# EAGLE design 236_pressure (EAGLE 9.6.2)
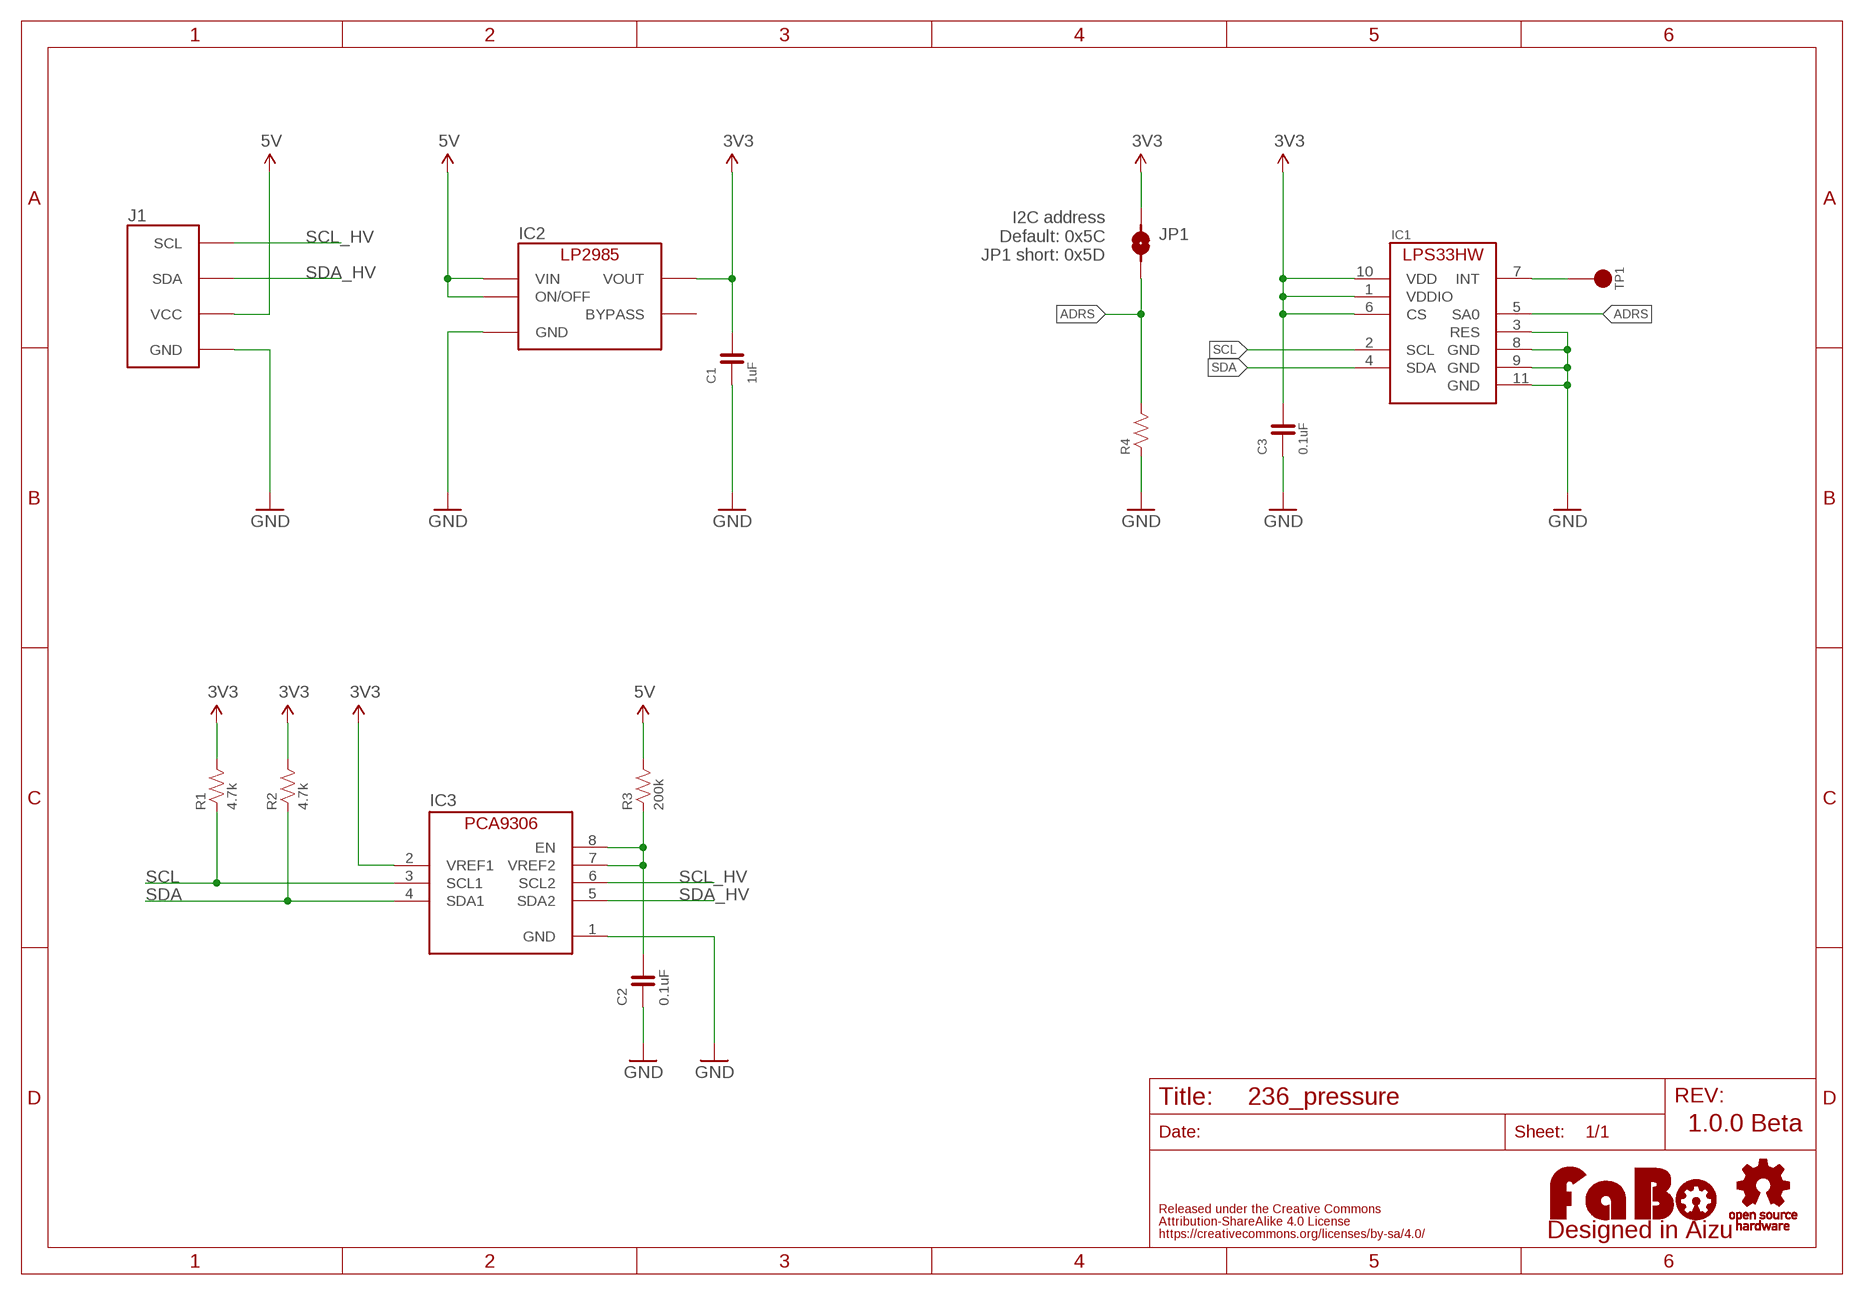
[diagram p0: schematic, sheet 1]

## Parts
C1  1uF  CAPACITOR-0603  [EIA0603]
C2  0.1uF  CAPACITOR-0603  [0603]
C3  0.1uF  CAPACITOR-0603  [EIA0603]
IC1  LPS33HW  [LPS33HW]
IC2  LP2985-33DBV  [SOT-23-5]
IC3  PCA9306GM  [XQFN8]
J1  FABO_BRICK_I2C  [FABO_BRICK_I2C]
JP1  JUMPER-2_SMD  [JUMPER-SMD-2]
LOGO1  LOGO_FABO-M  [LOGO_FABO_M]
R1  4.7k  RESISTOR-0603  [0603]
R2  4.7k  RESISTOR-0603  [0603]
R3  200k  RESISTOR-0603  [0603]
R4  RESISTOR-0603  [EIA0603]
TP1  TP-15  [TP-15]
U$2  LOGO_OSHW-M_BOTTOM  [LOGO_OSHW_M_BOTTOM]

## Nets
3V3: C1.2 C3.2 IC1.1(VDDIO) IC1.6(CS) IC1.10(VDD) IC2.5(VOUT) IC3.2(VREF1) JP1.1 R1.2 R2.2
5V: IC2.1(VIN) IC2.3(ON/OFF) J1.VCC R3.2
ADRS: IC1.5(SA0) JP1.2 R4.2
GND: C1.1 C2.1 C3.1 IC1.3(RES) IC1.8(GND) IC1.9(GND) IC1.11(GND) IC2.2(GND) IC3.1(GND) J1.GND R4.1
N$1: C2.2 IC3.7(VREF2) IC3.8(EN) R3.1
N$5: IC1.7(INT) TP1.1
SCL: IC1.2(SCL) IC3.3(SCL1) R1.1
SCL_HV: IC3.6(SCL2) J1.SCL
SDA: IC1.4(SDA) IC3.4(SDA1) R2.1
SDA_HV: IC3.5(SDA2) J1.SDA
Unconnected: IC2.4(BYPASS)

## Notes on the sheet
- I2C address
  Default: 0x5C
  JP1 short: 0x5D
- 1.0.0 Beta

## Library data of the parts
C1 C3 = component:CAPACITOR
C2 = FaBo-Capacitor:CAPACITOR: CAPACITOR
IC1 = component:LPS33HW
IC2 = FaBo-Supply:LP2985: LP2985
IC3 = FaBo-LevelTranslator:PCA9306
J1 = FaBo-Template:FABO_BRICK_I2C: FaBo Brick I2C
JP1 = component:JUMPER-2
LOGO1 = component:LOGO_FABO
R1-R3 = FaBo-Resistors:RESISTOR: RESISTOR
R4 = component:RESISTOR
TP1 = component:TP
U$2 = FaBo-etc:LOGO_OSHW

## Board
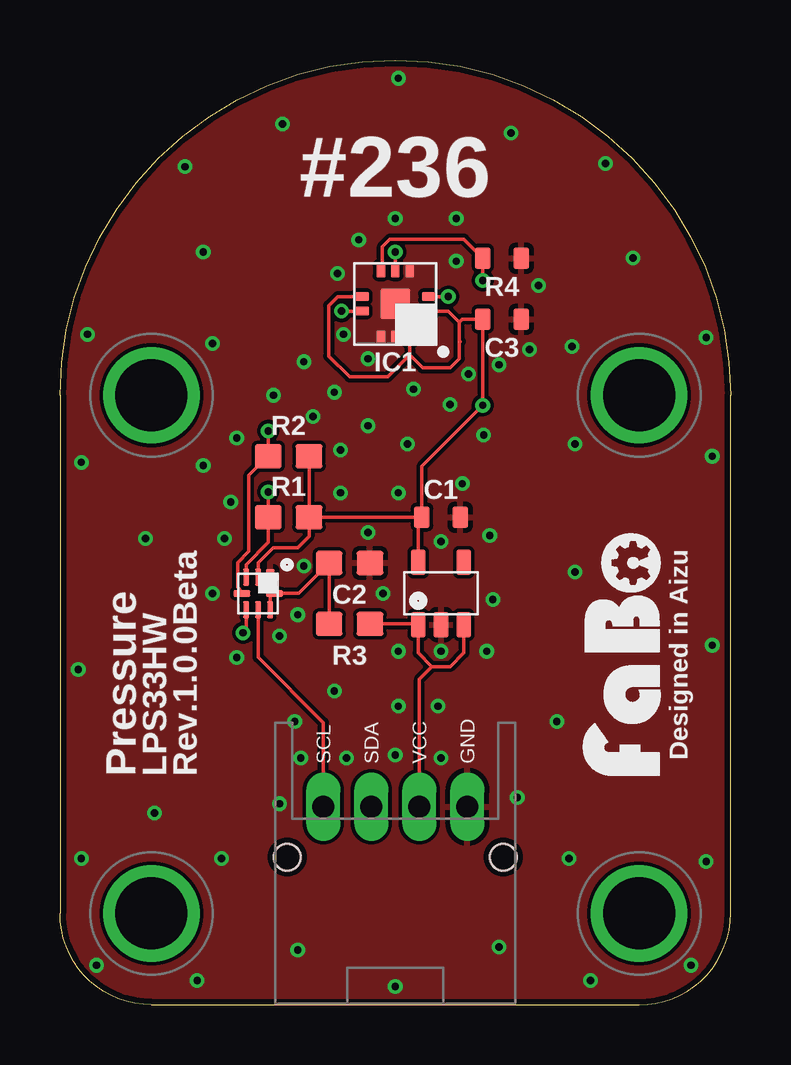
[diagram p1: board, top side]
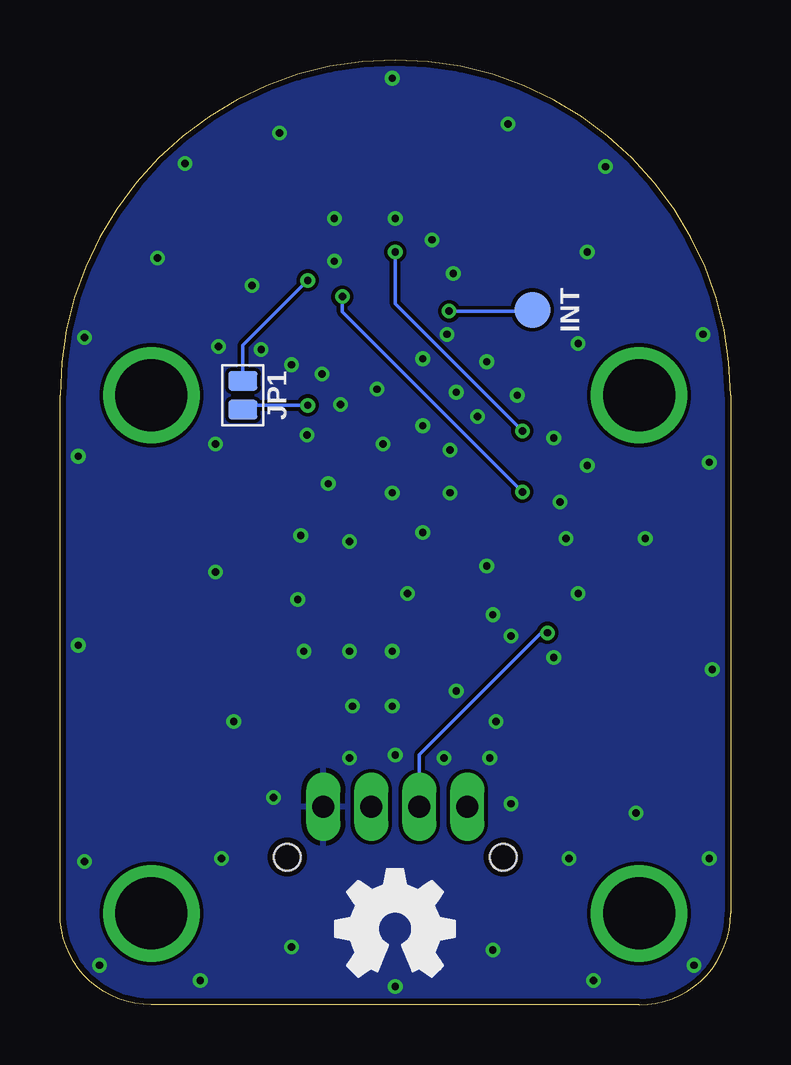
[diagram p2: board, bottom side, seen from below]

Size 27.94 x 39.37 mm. Coordinates in mm from the lower left corner, seen from the top.
Copper layers (1*16): Top 0.035mm / dielectric 1.6mm / Bottom 0.035mm
Design rules "PCBway": minimum track width 6mil, minimum drill 12mil, track to track 6mil, track to pad 6mil, pad to pad 6mil, via to via 6mil, smd to smd 6mil, copper to edge 10mil, drill to drill 10mil, minimum pad ring 10mil, minimum via ring 6mil, stop-mask expansion 2mil, vias tented up to drill 100mil, thermal gap 8mil

### Footprints (pad centres in the part's own frame; a part is rotated, then mirrored left to right if it is on the bottom)
EIA0603 = smd 0.65 x 0.9: 1 -0.8,0; 2 0.8,0
0603 = smd 1.1 x 1: 1 -0.85,0; 2 0.85,0
LPS33HW = smd 0.6 x 0.375: 1 -1.4,0.3; 2 -1.4,-0.3; 6 1.4,-0.3; 7 1.4,0.3 | smd 0.375 x 0.6: 3 -0.6,-1.4; 4 0,-1.4; 5 0.6,-1.4; 8 0.6,1.4; 9 0,1.4; 10 -0.6,1.4 | smd 1.25 x 1.25: 11 0,0
SOT-23-5 = smd 0.6 x 1.05: 1 -0.95,-1.3; 2 0,-1.3; 3 0.95,-1.3; 4 0.95,1.3; 5 -0.95,1.3
XQFN8 = smd 0.7 x 0.35: 1 -0.675,0.5 | smd 0.7 x 0.25: 2 -0.675,0; 3 -0.675,-0.5; 5 0.675,-0.5; 6 0.675,0; 7 0.675,0.5 | smd 0.25 x 0.7: 4 0,-0.675; 8 0,0.675
FABO_BRICK_I2C = drill 0.9 pad 1.422 long: GND 3,-10.795; SCL -3,-10.795; SDA -1,-10.795; VCC 1,-10.795 | drill 3 pad 3.81: P$1 -10.16,6.35; P$2 10.16,6.35; P$3 -10.16,-15.24; P$4 10.16,-15.24 | hole 1.1: -4.5,-12.895; 4.5,-12.895
JUMPER-SMD-2 = smd 0.8 x 1.2: 1 -0.6,0; 2 0.6,0
TP-15 = smd 1.5 x 1.5: 1 0,0

### Placement (x,y rotation side)
C1  15.88,20.32 180 top
C2  12.06,18.41 180 top
C3  18.41,28.57 180 top
IC1  13.97,29.21 180 top
IC2  15.88,17.14 0 top
IC3  8.26,17.14 270 top
J1  13.97,19.05 0 top
JP1  20.32,25.4 90 bottom
LOGO1  25.4,14.61 90 top
R1  9.53,20.32 0 top
R2  9.53,22.86 0 top
R3  12.06,15.88 0 top
R4  18.41,31.11 180 top
TP1  8.26,28.96 0 bottom
U$2  13.97,3.17 0 top

### Tracks (layer width: path | path; a pad name or v marks a point on that pad's centre or on a via)
3V3  (via drill 0.3)
  Top 0.152: C1.2 15.07,22.44 v17.61,24.98 C3.2 16.76,28.57 16.64,28.45 | 16.68,27.64 16.64,27.64 | IC1.10 14.57,27.09 | 14.57,27.09 15.11,26.54 16.26,26.54 16.64,26.92 16.64,27.64 | IC1.1 16.18,28.91 16.64,28.45 | 16.64,27.64 16.64,28.45 | IC1.6 11.58,29.51 11.2,29.13 11.2,27.03 12.06,26.16 13.65,26.16 14.57,27.09 | IC2.5 14.93,20.17 C1.2 | C1.2 R1.2 | R1.2 R2.2 | IC3.2 8.26,18.41 8.89,19.05 9.91,19.05 10.38,19.52 R1.2
  Bottom 0.152: JP1.1 20.14,24.98 v17.61,24.98
5V
  Top 0.152: 15.49,14.1 14.93,14.67 IC2.1 14.89,15.88 R3.2 | IC2.3 16.82,14.67 16.26,14.1 15.49,14.1 | J1.VCC 14.97,13.57 15.49,14.1
ADRS  (via drill 0.3)
  Top 0.152: IC1.5 13.44,30.68 13.44,31.59 13.75,31.9 16.83,31.9 R4.2 v17.61,30.19
  Bottom 0.152: v17.61,30.19 20.32,27.48 JP1.2
GND  (via drill 0.3)
  other vias: 15.88,14.73 12.83,26.92 11.81,27.94 17.02,26.29 18.29,26.67 19.56,27.3 21.34,27.43 16.51,30.99 11.43,25.53 10.16,26.8 12.83,24.13 11.68,23.11 10.54,24.51 8.89,25.4 7.37,23.62 16.51,32.77 13.97,32.77 14.73,25.65 16.26,25.02 17.65,23.75 21.46,23.37 14.1,21.34 11.68,21.34 7.11,20.95 6.35,27.56 0.89,22.61 1.14,27.94 26.92,27.81 27.18,22.86 16.76,21.72 14.48,23.37 11.56,30.48 12.45,31.88 19.94,29.97 14.1,38.61 5.21,34.92 22.73,35.05 23.88,31.11 18.8,36.32 9.27,36.7 5.97,31.37 5.97,22.48 12.83,19.68 17.91,19.56 6.86,19.43 9.91,16.26 10.16,18.29 13.46,17.14 15.88,19.3 18.03,16.89 17.78,14.73 14.1,14.73 6.35,17.14 9.14,15.37 7.37,14.48 0.89,6.1 6.73,6.1 21.21,6.1 26.92,5.97 26.29,1.65 22.1,1.02 5.71,1.02 1.52,1.65 27.18,14.99 0.76,13.97 3.56,19.43 3.94,8 21.46,18.03 20.7,11.81 13.97,0.76 18.29,2.41 9.91,2.29 9.78,11.81 11.43,13.08 13.97,10.41 11.94,10.29 10.03,10.29 15.88,10.29 19.05,8.64 9.14,8.38 14.1,12.45 15.75,12.45
  pour Top (isolate 0.152, rank 3): 0,0 27.94,0 27.94,39.37 0,39.37
  pour Bottom (isolate 0.152, rank 3): 0,0 27.94,0 27.94,39.37 0,39.37
  pour Top (isolate 0.152, rank 2, no thermals): 12.06,31.11 16.51,31.11 16.51,26.67 12.06,26.67
N$1
  Top 0.152: IC3.7 8.76,17.14 IC3.8 9.95,17.14 C2.2 R3.1
N$5  (via drill 0.3)
  Top 0.152: IC1.7 v11.73,28.91
  Bottom 0.152: v11.73,28.91 8.3,28.91 TP1.1
SCL  (via drill 0.3)
  Top 0.152: IC1.2 v16.18,29.51 | v8.68,21.38 R1.1 8.68,19.27 7.75,18.35 IC3.3
  Bottom 0.152: v8.68,21.38 16.18,28.88 v16.18,29.51
SCL_HV
  Top 0.152: IC3.6 8.26,14.48 10.97,11.76 J1.SCL
SDA  (via drill 0.3)
  Top 0.152: IC1.4 v13.97,31.37 | v8.68,23.91 R2.1 7.87,22.06 7.87,18.9 7.4,18.42 7.4,17.4 7.58,17.22 IC3.4
  Bottom 0.152: v8.68,23.91 13.97,29.21 v13.97,31.37
SDA_HV  (via drill 0.3)
  Top 0.152: IC3.5 7.75,15.63 v7.63,15.5
  Bottom 0.152: v7.63,15.5 7.88,15.5 12.97,10.41 J1.SDA

### Text on the board
tPlace: #236 | Designed in Aizu | Pressure | LPS33HW | Rev.1.0.0Beta
bPlace: INT